# EasyEDA Pro project solar_panel_full.eprj

# Schematic Schematic1
Board Name: Board1; Create Date: 2026-05-23; Page Name: P1; Project Name: solar_panel_full; Schematic Name: Schematic1; Update Date: 2026-05-23; Company: EasyEDA.com; Page Size: A4; Version: V1.0
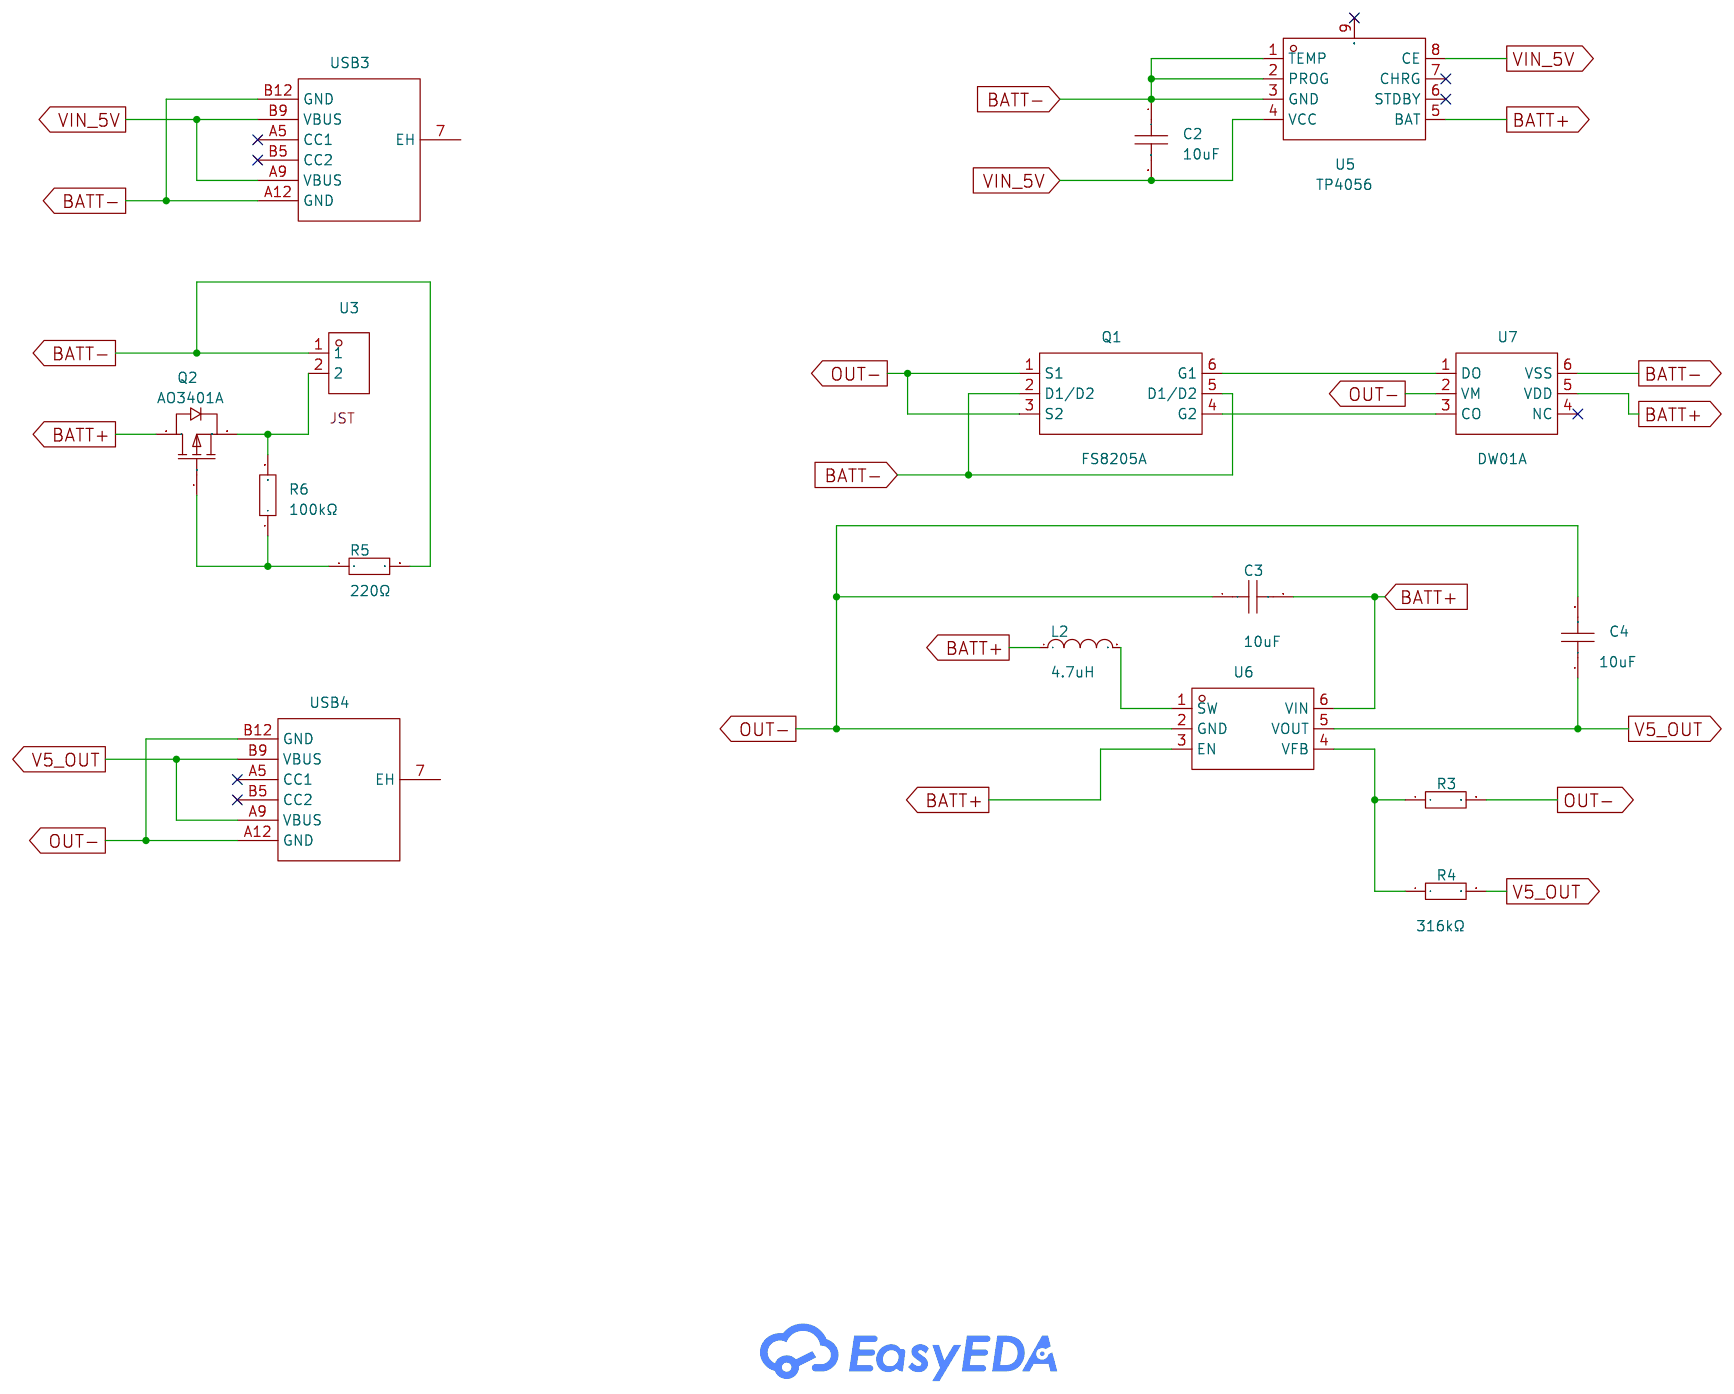
[diagram p0: schematic sheet]

## Parts
C2  10uF  [C0603]
C3  10uF  [C0603]
C4  10uF  [C0603]
L2  4.7uH  [L0805]
Q1  FS8205A  [SOT-23-6_L2.9-W1.6-P0.95-LS2.8-BR]
Q2  AO3401A  [SOT-23_L2.9-W1.3-P1.90-LS2.4-BR]
R3  100kΩ  [R0603]
R4  316kΩ  [R0603]
R5  220Ω  [R0603]
R6  100kΩ  [R0603]
U3  S2B-PH-SM4-TB(LF)(SN)  [CONN-SMD_P2.00_S2B-PH-SM4-TB-LF-SN]
U5  TP4056  [ESOP-8_L4.9-W3.9-P1.27-LS6.0-BL-EP-4]
U6  MCP1640BT-I/CHY  [SOT-23-6_L2.9-W1.6-P0.95-LS2.8-BR]
U7  DW01A  [SOT-23-6_L2.9-W1.6-P0.95-LS2.9-BL]
USB3  TYPE-C 6P  [TYPE-C-SMD_TYPE-C-6P_1]
USB4  TYPE-C 6P  [TYPE-C-SMD_TYPE-C-6P_1]

## Library data of the parts
C2-C4 = C0603B106M007T: Capacitance:10uF Tolerance:±20% Tolerance:±20% Voltage Rating:6.3V Temperature Coefficient:X5R; LCSC Part Name: 10uF ±20% 6.3V; Supplier Part: C7094065; Manufacturer: IHHEC(禾伸堂); Supplier Footprint: 0603; JLCPCB Part Class: Extended Part; Datasheet: https://item.szlcsc.com/datasheet/C0603B106M007T/8060709.html; Supplier: LCSC; Tolerance: ±20%; Voltage Rating: 6.3V; Temperature Coefficient: X5R
L2 = CPY201209T-4R7M-NP: LCSC Part Name: 4.7uH ±20%; Supplier Part: C285965; Manufacturer: Chilisin(奇力新); Supplier Footprint: 0805; JLCPCB Part Class: Extended Part; Datasheet: https://item.szlcsc.com/datasheet/CPY201209T-4R7M-NP/271270.html; Supplier: LCSC; Tolerance: ±20%
Q1 = FS8205A_C908265: LCSC Part Name: 2个N沟道 耐压:20V 电流:6A; Supplier Part: C908265; Manufacturer: FUXINSEMI(富芯森美); Supplier Footprint: SOT-23-6L; JLCPCB Part Class: Extended Part; Datasheet: https://atta.szlcsc.com/upload/public/pdf/source/20201027/C908265_C6F1A5E0FB14735EF799FEF607A99450.pdf; Supplier: LCSC; Type: 2 N-Channel; Drain to Source Voltage: 20V; RDS(on): 18mΩ@4.5V,6A; Pd - Power Dissipation: 1.5W; Gate Threshold Voltage (Vgs(th)@Id): 1.2V; Gate Charge(Qg): 11nC@4.5V; Input Capacitance(Ciss@Vds): 800pF@8V; Reverse Transfer Capacitance (Crss@Vds): 125pF@8V; Operating Temperature: -55℃~+150℃@(Tj)
Q2 = AO3401A_C15127: LCSC Part Name: 1个P沟道 耐压:30V 电流:4A; Supplier Part: C15127; Manufacturer: AOS; Supplier Footprint: SOT-23; JLCPCB Part Class: Basic Part; Datasheet: https://item.szlcsc.com/datasheet/AO3401A/15801.html; Supplier: LCSC; Number: 1 P-Channel; Drain to Source Voltage: 30V; Current - Continuous Drain(Id): 4A; RDS(on): 47mΩ@10V；85mΩ@2.5V；60mΩ@4.5V; Gate Threshold Voltage (Vgs(th)): 900mV; Gate Charge(Qg): 14nC@10V; Input Capacitance(Ciss): 645pF; Reverse Transfer Capacitance (Crss@Vds): 55pF; Output Capacitance(Coss): 80pF
R3 = FRC0603J104 TS: Type:Thick Film Resistor Resistance:100kΩ Tolerance:±5% Tolerance:±5% Power(Watts):100mW Voltage-Supply(Max):75V Temperature Coefficient:±100ppm/℃ Temperature Coefficient:±100ppm/℃ Operating Temperature:-55℃~+155℃ Operating Temperature:-55℃~+155℃; LCSC Part Name: 100kΩ ±5% 100mW 厚膜电阻; Supplier Part: C2907088; Manufacturer: FOJAN(富捷); Supplier Footprint: 0603; JLCPCB Part Class: Extended Part; Supplier: LCSC; Type: Thick Film Resistor; Tolerance: ±5%; Power(Watts): 100mW; Voltage-Supply(Max): 75V; Temperature Coefficient: ±100ppm/℃; Operating Temperature: -55℃~+155℃
R4 = FRC0603F3163TS: Type:Thick Film Resistor Resistance:316kΩ Tolerance:±1% Tolerance:±1% Power(Watts):100mW Voltage-Supply(Max):75V Temperature Coefficient:±100ppm/℃ Temperature Coefficient:±100ppm/℃ Operating Temperature:-55℃~+155℃ Operating Temperature:-55℃~+155℃; LCSC Part Name: 316kΩ ±1% 100mW 厚膜电阻; Supplier Part: C2998125; Manufacturer: FOJAN(富捷); Supplier Footprint: 0603; JLCPCB Part Class: Extended Part; Supplier: LCSC; Type: Thick Film Resistor; Tolerance: ±1%; Power(Watts): 100mW; Voltage-Supply(Max): 75V; Temperature Coefficient: ±100ppm/℃; Operating Temperature: -55℃~+155℃
R5 = SCR0603J220R: Type:Thick Film Resistors Resistance: Tolerance:±5% Tolerance:±5% Power(Watts): Overload Voltage (Max): Operating Temperature Range:-55℃~+155℃ Operating Temperature Range:-55℃~+155℃; LCSC Part Name: 厚膜电阻 220Ω ±5% 100mW; Supplier Part: C3017752; Manufacturer: VO(翔胜); Supplier Footprint: 0603; JLCPCB Part Class: Extended Part; Datasheet: https://atta.szlcsc.com/upload/public/pdf/source/20220513/247AF9639BA21CF93567DC289CCC6A22.pdf; Supplier: LCSC; Type: Thick Film Resistors; Tolerance: ±5%; Operating Temperature Range: -55℃~+155℃
R6 = FCR0603F100K: Type:Thick Film Resistors Resistance: Tolerance:±1% Tolerance:±1% Power(Watts): Overload Voltage (Max): Operating Temperature Range:-55℃~+155℃ Operating Temperature Range:-55℃~+155℃; LCSC Part Name: 100K ±1%; Supplier Part: C5913165; Manufacturer: VO(翔胜); Supplier Footprint: 0603; JLCPCB Part Class: Extended Part; Datasheet: https://atta.szlcsc.com/upload/public/pdf/source/20230428/98B65D379E9BA4CF2A9223D1647B01B6.pdf; Supplier: LCSC; Type: Thick Film Resistors; Tolerance: ±1%; Operating Temperature Range: -55℃~+155℃
U3 = S2B-PH-SM4-TB(LF)(SN): LCSC Part Name: 1x2P 间距:2mm 卧贴 系列:PH; Supplier Part: C295747; Manufacturer: JST; Supplier Footprint: SMD,P=2mm,卧贴; JLCPCB Part Class: Extended Part; Datasheet: https://atta.szlcsc.com/upload/public/pdf/source/20210203/C295747_344B2E64535E381E727D98C302AB61C7.pdf; Supplier: LCSC; Pins Structure: 1x2P; Pitch: 2mm; Mounting Style: Horizontal attachment; Reference Series: PH; Number of Pins: 2P; Number of Rows: 1; Number of PINs Per Row: 2; Current Rating (Max): 2A; Contact Material: Copper alloy; Contact Plating: Tin; Operating Temperature Range: -25℃~+85℃; Rated Voltage (Max): 100V; Plastic Material: PA; Flame Retardant Rating: UL94V-0; Supplementary Features: Auxiliary soldering legs; Colour: Beige; Z-Height of the Board: 5.5mm; X-Length of Bottom Edge on Board (Spacing Line): 7.9mm; Y-Width of Bottom Edge on Board: 8.6mm
U5 = TP4056_C20199357: The Chip Type:Charging IC Voltage - Supply:-300mV~8V Voltage - Supply:-300mV~8V Charge Current - Max:1A Charging Saturation Voltage:4.2V End-Off Voltage:- Type of Battery:Lithium Battery Number of Cells:1 Number of Cells:1 Operating Temperature:-40℃~+85℃; LCSC Part Name: 线性锂电池充电芯片; Supplier Part: C20199357; Manufacturer: YONGYUTAI(永裕泰); Supplier Footprint: ESOP-8; JLCPCB Part Class: Extended Part; Datasheet: https://item.szlcsc.com/datasheet/TP4056/21524593.html; Supplier: LCSC; The Chip Type: Charging IC; Voltage - Supply: -300mV~8V; Charge Current - Max: 1A; Charging Saturation Voltage: 4.2V; Type of Battery: Lithium Battery; Number of Cells: 1; Operating Temperature: -40℃~+85℃; Battery Temperature Detection: Support; Supply Current (Iq): 100uA
U6 = MCP1640BT-I/CHY: LCSC Part Name: 具备真输出断开或输入/输出旁路选项的 0.65V 启动同步升压调节器; Supplier Part: C478087; Manufacturer: MICROCHIP(美国微芯); Supplier Footprint: SOT-23-6; JLCPCB Part Class: Extended Part; Datasheet: https://item.szlcsc.com/datasheet/MCP1640BT-I%252FCHY/485396.html; Supplier: LCSC; Function: Boost; Voltage - Supply: 800mV~5.5V; Output Voltage: 2V~5.5V; Output Current: 350mA; Frequency - Switching: 500kHz; Operating Temperature: -40℃~+125℃@(TJ); Synchronous Rectifier: Yes; Number of Outputs: 1; Topology: Boost; Quiescent Current: 19uA; Switch tube (built-in/external): Built-In; Output Type: Adjustable
U7 = DW01A_C42380662: LCSC Part Name: SOT23-6塑封封装锂电池保护IC; Supplier Part: C42380662; Manufacturer: Slkor(萨科微); Supplier Footprint: SOT-23-6; JLCPCB Part Class: Extended Part; Datasheet: https://item.szlcsc.com/datasheet/DW01A/44291671.html; Supplier: LCSC; The Chip Type: Protection IC; Voltage - Supply: 1.5V~10V; End-Off Voltage: 2.5V; Type of Battery: Lithium Battery; Number of Cells: 1; Operating Temperature: -40℃~+85℃; Battery Temperature Detection: Not supported; 0V Battery Charge: Support; Supply Current (Iq): 700nA
USB3 USB4 = TYPE-C 6P: LCSC Part Name: 6P卧贴母座; Supplier Part: C456012; Manufacturer: SHOU HAN(首韩); Supplier Footprint: SMD; JLCPCB Part Class: Extended Part; Datasheet: https://item.szlcsc.com/datasheet/TYPE-C%25206P/458819.html; Supplier: LCSC; Connector Type: Type-C; Gender: Female; Mounting Type: Surface Mount, Right Angle; Number of Contacts: 6P; Number of Ports: 1; Current Rating-Power: 3A; Voltage Rating: 5V; Connect-Disconnect Life: 3,000 Cycles; Detection color: Black; Operating Temperature: -40℃~+85℃

## Nets
V5_OUT: C4.1 R4.2 U6.5(VOUT) USB4.A9(VBUS) USB4.B9(VBUS)
VIN_5V: C2.2 U5.4(VCC) U5.8(CE) USB3.A9(VBUS) USB3.B9(VBUS)
BATT+: C3.2 L2.1 Q2.3(D) U5.5(BAT) U6.3(EN) U6.6(VIN) U7.5(VDD)
BATT-: C2.1 Q1.2(D1/D2) Q1.5(D1/D2) R5.2 U3.1 U5.1(TEMP) U5.2(PROG) U5.3(GND) U7.6(VSS) USB3.A12(GND) USB3.B12(GND)
OUT-: C3.1 C4.2 Q1.1(S1) Q1.3(S2) R3.2 U6.2(GND) U7.2(VM) USB4.A12(GND) USB4.B12(GND)
$1N2456: Q1.6(G1) U7.1(DO)
$1N2890: Q1.4(G2) U7.3(CO)
$1N2995: L2.2 U6.1(SW)
$1N3037: R3.1 R4.1 U6.4(VFB)
$1N4099: Q2.2(S) R6.2 U3.2
$1N4219: Q2.1(G) R5.1 R6.1

Not connected (* = marked no-connect by the designer): U5 6(STDBY)* 7(CHRG)* 9(PAD)*; U7 4(NC)*; USB3 7(EH) A5(CC1)* B5(CC2)*; USB4 7(EH) A5(CC1)* B5(CC2)*

# Board PCB1
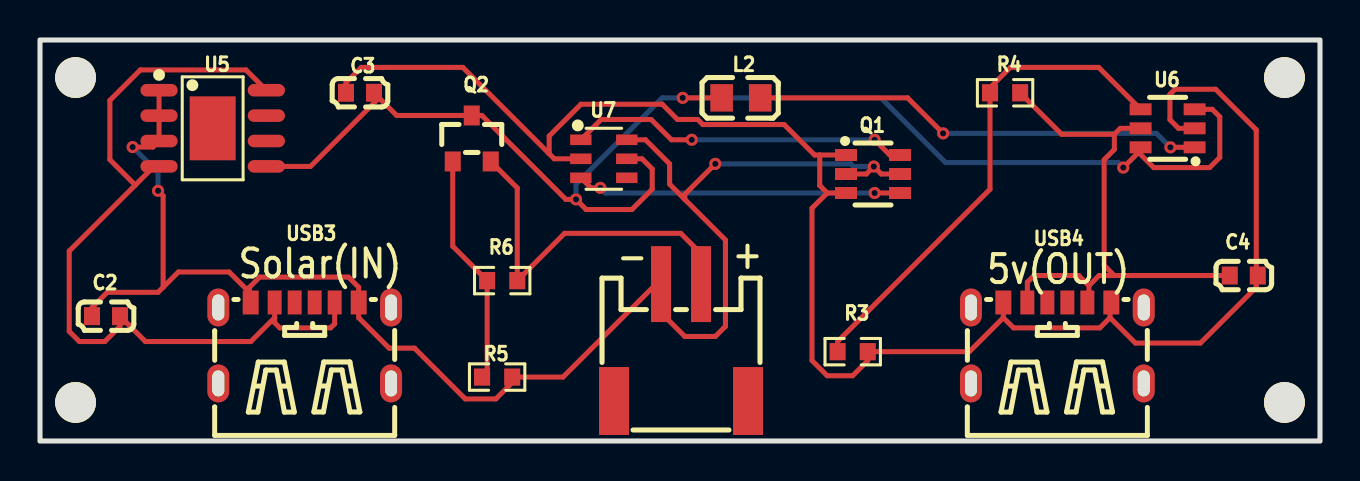
[diagram p1: board, top side]
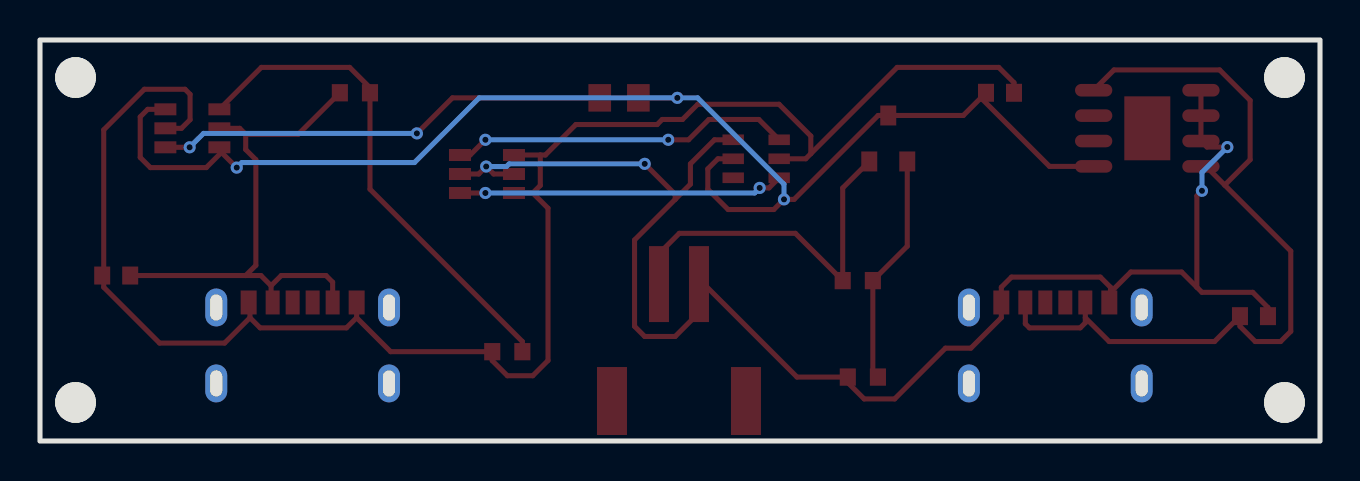
[diagram p2: board, bottom side, seen from below]

Outline 64.01 x 20.07 mm; copper layers: Top Layer, Bottom Layer. Coordinates in mm from the lower left corner of the outline.
Outline path: rectangle 0,20.07 64.01,0
Stack: Top Layer 0.035mm / Dielectric1 1.51mm FR4 er 4.5 / Bottom Layer 0.035mm

## Design rules (mm)
template: Custom Config
spacing copperThickness1oz (default): track to track 0.5, other pairs 0.152 to 0.3
spacing copperThickness2oz: track to track 0.203, other pairs 0.152 to 0.3
track width copperThickness1oz (default): min 0.127, default 0.254, max 2.54
track width copperThickness2oz: min 0.203, default 0.254, max 2.54
differential pair differentialPair (default): width min 0.127, default 0.254, max 2.54; gap min 0.152, default 0.152
via viaSize (default): diameter min 0.5, default 0.61, max 10; hole min 0.3, default 0.305, max 6.3

## Placement (name value [footprint] x y rotation side)
C2  10uF  [C0603]  3.3 6.25 0 top
C3  10uF  [C0603]  16 17.42 0 top
C4  10uF  [C0603]  60.2 8.28 0 top
L2  4.7uH  [L0805]  35.05 17.17 0 top
NOREF  -  [Pad_e212]  1.78 1.93 0 top
NOREF#2  -  [Pad_e211]  62.23 18.19 0 top
NOREF#3  -  [Pad_e208]  1.78 18.19 0 top
NOREF#4  -  [Pad_e213]  62.23 1.93 0 top
Q1  FS8205A  [SOT-23-6_L2.9-W1.6-P0.95-LS2.8-BR]  41.66 13.36 180 top
Q2  AO3401A  [SOT-23_L2.9-W1.3-P1.90-LS2.4-BR]  21.59 15.14 270 top
R3  100kΩ  [R0603]  40.64 4.47 0 top
R4  316kΩ  [R0603]  48.26 17.42 0 top
R5  220Ω  [R0603]  22.86 3.2 0 top
R6  100kΩ  [R0603]  23.11 8.03 0 top
U3  S2B-PH-SM4-TB(LF)(SN)  [CONN-SMD_P2.00_S2B-PH-SM4-TB-LF-SN]  32.05 4.93 0 top
U5  TP4056  [ESOP-8_L4.9-W3.9-P1.27-LS6.0-BL-EP-4]  8.64 15.65 270 top
U6  MCP1640BT-I/CHY  [SOT-23-6_L2.9-W1.6-P0.95-LS2.8-BR]  56.39 15.65 0 top
U7  DW01A  [SOT-23-6_L2.9-W1.6-P0.95-LS2.9-BL]  28.19 14.12 270 top
USB3  TYPE-C 6P  [TYPE-C-SMD_TYPE-C-6P_1]  13.24 4.91 0 top
USB4  TYPE-C 6P  [TYPE-C-SMD_TYPE-C-6P_1]  50.87 4.91 0 top

## Footprints (pads in the part's own frame, mm; a bottom-side part is the same pattern mirrored in y, then rotated)
C0603
  rect 0.8x0.9 smd: 1(-0.7,0) 2(0.7,0)
CONN-SMD_P2.00_S2B-PH-SM4-TB-LF-SN
  rect 1x3.8 smd: 1(-1,2.925) 2(1,2.925)
  rect 1.5x3.4 smd: 3(3.35,-2.925) 4(-3.35,-2.925)
ESOP-8_L4.9-W3.9-P1.27-LS6.0-BL-EP-4
  oval 0.63x1.865 smd: 1(-1.905,-2.683) 2(-0.635,-2.683) 3(0.635,-2.683) 4(1.905,-2.683) 5(1.905,2.683) 6(0.635,2.683) 7(-0.635,2.683) 8(-1.905,2.683)
  rect 3.2x2.3 smd: 9(0,0)
L0805
  rect 1.133x1.377 smd: 1(-0.966,0) 2(0.966,0)
Pad_e208
  round 2.032 hole 2.54x2.032: 1(0,0)
Pad_e211
  round 2.032 hole 2.032: 2(0,0)
Pad_e212
  round 2.032 hole 2.032: 3(0,0)
Pad_e213
  round 2.032 hole 2.032: 4(0,0)
R0603
  rect 0.806x0.864 smd: 1(-0.753,0) 2(0.753,0)
SOT-23-6_L2.9-W1.6-P0.95-LS2.8-BR
  rect 1.1x0.6 smd: 1(1.35,-0.95) 2(1.35,0) 3(1.35,0.95) 4(-1.35,0.95) 5(-1.35,0) 6(-1.35,-0.95)
SOT-23-6_L2.9-W1.6-P0.95-LS2.9-BL
  rect 0.532x1.072 smd: 1(-0.95,-1.149) 2(0,-1.149) 3(0.95,-1.149) 4(0.95,1.149) 5(0,1.149) 6(-0.95,1.149)
SOT-23_L2.9-W1.3-P1.90-LS2.4-BR
  rect 1x0.8 smd: 1(1.15,-0.95) 2(1.15,0.95) 3(-1.15,0)
TYPE-C-SMD_TYPE-C-6P_1
  oval 1.1x1.9 hole 0.6x1.3: 7(-4.32,1.775) 7(-4.32,-2.025) 7(4.32,1.775) 7(4.32,-2.025)
  rect 0.7x1.2 smd: A5(-0.5,2.025) A9(1.5,2.025) B5(0.5,2.025) B9(-1.5,2.025)
  rect 0.8x1.2 smd: A12(2.7,2.025) B12(-2.7,2.025)

## Nets
As in the schematic.

Pads without a net: NOREF 3; NOREF#2 2; NOREF#3 1; NOREF#4 4; U3 3 4; U5 6 7 9; U7 4; USB3 7 A5 B5; USB4 7 A5 B5

## Via types
v1: diameter 0.61, hole 0.305, Top Layer to Bottom Layer, 13 vias

## Routing (per net, layer and track width the routed paths; a pad name or vN(x,y) marks a point on that pad's centre or on a via; arc(x,y) is an arc through that point)
V5_OUT: length 27.1
  Top Layer w0.254: U6.5 54.02,15.65 53.72,15.35 ; C4.1 53.72,8.28 ; 53.72,8.28 53.21,8.79 53.21,14.08 53.72,14.58 53.72,15.35 ; 53.72,8.28 52.96,8.28 52.45,7.77 ; 53.72,15.35 51.09,15.35 R4.2 ; 52.45,7.77 52.45,7.01 USB4.A9 ; 52.45,7.77 51.94,8.28 49.71,8.28 49.37,7.95 USB4.B9
VIN_5V: length 41.5
  Top Layer w0.254: 4.76,12.81 1.46,9.5 1.46,5.49 1.97,4.98 3.24,4.98 4,5.74 C2.2 5.27,4.98 10.54,4.98 11.74,6.17 ; 4.76,12.81 3.49,14.08 3.49,17.04 5.02,18.57 10.3,18.57 U5.8 ; 4.76,12.81 5.7,13.74 U5.4 ; 11.74,6.17 11.74,5.92 11.99,5.66 14.53,5.66 14.74,5.87 USB3.A9 ; 11.74,6.17 USB3.B9
BATT+: length 69
  Top Layer w0.254: 54.93,14.44 55.69,13.68 58.49,13.68 59,14.19 59,16.22 58.62,16.6 U6.3 ; 54.93,14.44 54.93,14.59 U6.6 ; 54.93,14.44 v1(54.17,13.68) ; v1(32.14,17.17) L2.1 ; U5.5 13.53,13.74 16.96,17.17 ; 16.96,17.17 17.84,16.29 Q2.3 22.1,16.29 26.3,12.09 v1(26.8,12.09) 27.31,11.58 29.6,11.58 30.61,12.6 30.61,13.61 30.11,14.12 U7.5 ; 16.96,17.17 C3.2
  Bottom Layer w0.254: v1(54.17,13.68) 53.92,13.93 45.28,13.93 42.04,17.17 v1(32.14,17.17) 31.12,17.17 26.8,12.85 v1(26.8,12.09)
BATT-: length 79.3
  Top Layer w0.254: v1(33.77,13.87) 32.25,12.34 32.25,12.09 ; 6.16,7.69 6.92,8.46 9.46,8.46 10.48,7.44 ; 6.16,7.69 6.16,12.27 v1(5.9,12.52) ; 6.16,7.69 5.9,7.44 3.36,7.44 2.6,6.68 C2.1 ; 30.98,7.77 30.73,7.77 26.15,3.2 R5.2 23.56,3.14 23.56,2.87 22.79,2.11 21.27,2.11 18.73,4.65 17.46,4.65 15.94,6.17 USB3.A12 15.94,7.69 15.43,8.2 10.98,8.2 10.48,7.69 10.48,7.44 ; 30.98,7.77 U3.1 ; 30.98,7.77 30.98,6.5 32.25,5.23 33.77,5.23 34.28,5.74 34.28,10.06 32.25,12.09 ; 10.48,7.44 10.48,6.99 USB3.B12 ; Q1.5 42.07,13.36 v1(41.7,13.73) 41.32,13.36 Q1.2 ; 32.25,12.09 31.48,12.85 31.48,13.87 30.28,15.07 U7.6 ; v1(4.63,14.71) 5.65,14.71 U5.3 U5.2 U5.1
  Bottom Layer w0.254: v1(4.63,14.71) 5.9,13.44 v1(5.9,12.52) ; v1(41.7,13.73) 40.68,13.73 40.55,13.87 v1(33.77,13.87)
OUT-: length 87.2
  Top Layer w0.254: 25.46,14.38 21.14,18.69 16.06,18.69 15.3,17.93 C3.1 ; 25.46,14.38 25.46,15.26 27.05,16.85 31.12,16.85 31.88,16.09 32.89,16.09 33.15,15.83 37.21,15.83 38.74,14.31 38.99,14.31 ; 25.46,14.38 25.72,14.12 U7.2 ; 53.51,6.17 54.78,4.9 58.03,4.9 60.82,7.69 60.82,8.2 ; 53.51,6.17 53,5.66 48.68,5.66 48.17,6.17 ; 53.51,6.17 53.51,6.87 USB4.A12 ; 48.17,6.17 46.47,4.47 R3.2 41.39,4.02 40.64,3.27 39.37,3.27 38.6,4.03 38.6,11.65 39.37,12.41 ; 48.17,6.17 USB4.B12 ; 39.37,12.41 38.99,12.79 38.99,14.31 ; 39.37,12.41 Q1.3 ; 38.99,14.31 Q1.1 ; 60.82,8.2 C4.2 ; 60.82,8.2 60.82,15.57 58.79,17.6 56.76,17.6 56.5,17.35 56.5,16.08 56.93,15.65 U6.2
$1N2456: length 17.1
  Top Layer w0.254: U7.1 28.06,16.09 30.56,16.09 31.58,15.07 v1(32.59,15.07) ; v1(41.74,15.07) 42.5,14.31 Q1.6
  Bottom Layer w0.254: v1(41.74,15.07) v1(32.59,15.07)
$1N2890: length 16.3
  Top Layer w0.254: v1(28.02,12.66) 27.55,12.66 U7.3 ; Q1.4 v1(41.74,12.41)
  Bottom Layer w0.254: v1(28.02,12.66) 28.27,12.41 v1(41.74,12.41)
$1N2995: length 22.7
  Top Layer w0.254: v1(45.16,15.39) 43.38,17.17 L2.2 ; v1(56.53,14.7) U6.1
  Bottom Layer w0.254: v1(45.16,15.39) 55.83,15.39 v1(56.53,14.7)
$1N3037: length 25.2
  Top Layer w0.254: U6.4 52.94,18.69 48.52,18.69 47.51,17.68 R4.1 47.51,12.6 39.89,4.98 R3.1
$1N4099: length 18.6
  Top Layer w0.254: Q2.2 23.87,12.66 R6.2 26.23,10.39 32.04,10.39 33.05,9.38 U3.2
$1N4219: length 11.6
  Top Layer w0.254: Q2.1 20.64,9.75 R6.1 22.36,3.45 R5.1

## Text on the board
Top Silkscreen Layer: Solar(IN) | - | + | 5v(OUT)
